# EAGLE design PSPS_AVNC_SRD_sensors-2020-09-19 (EAGLE 9.6.2)
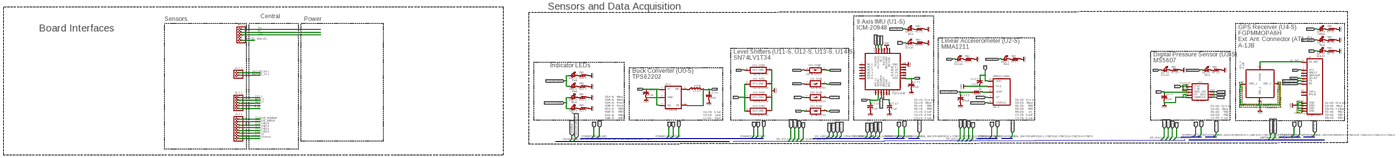
[diagram p0: schematic, sheet 1, overview]
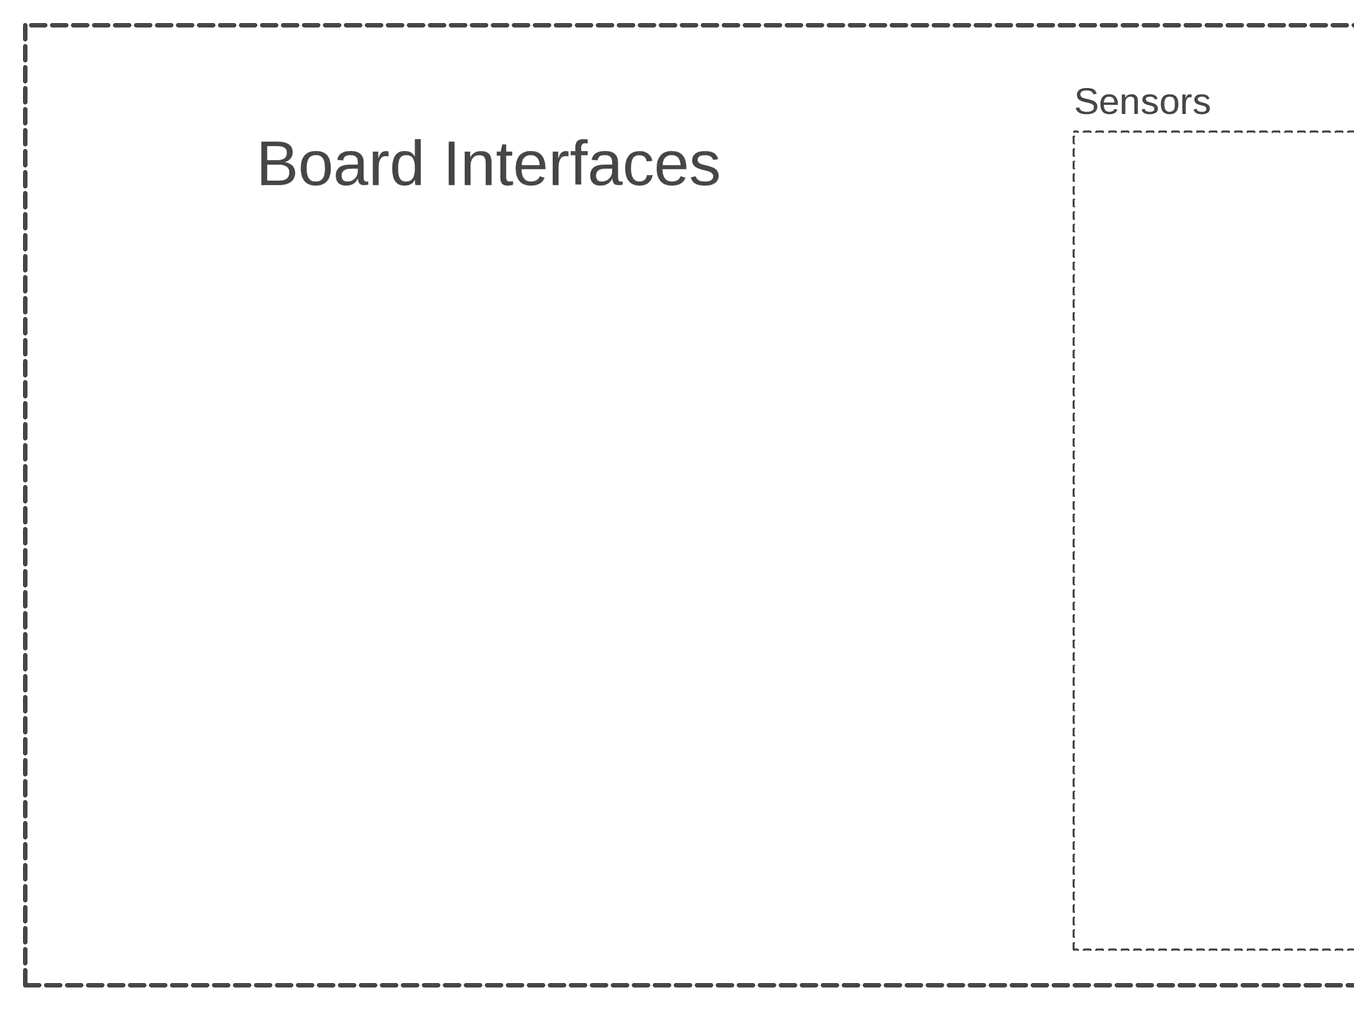
[diagram p1: schematic, sheet 1, part 1 of 4]
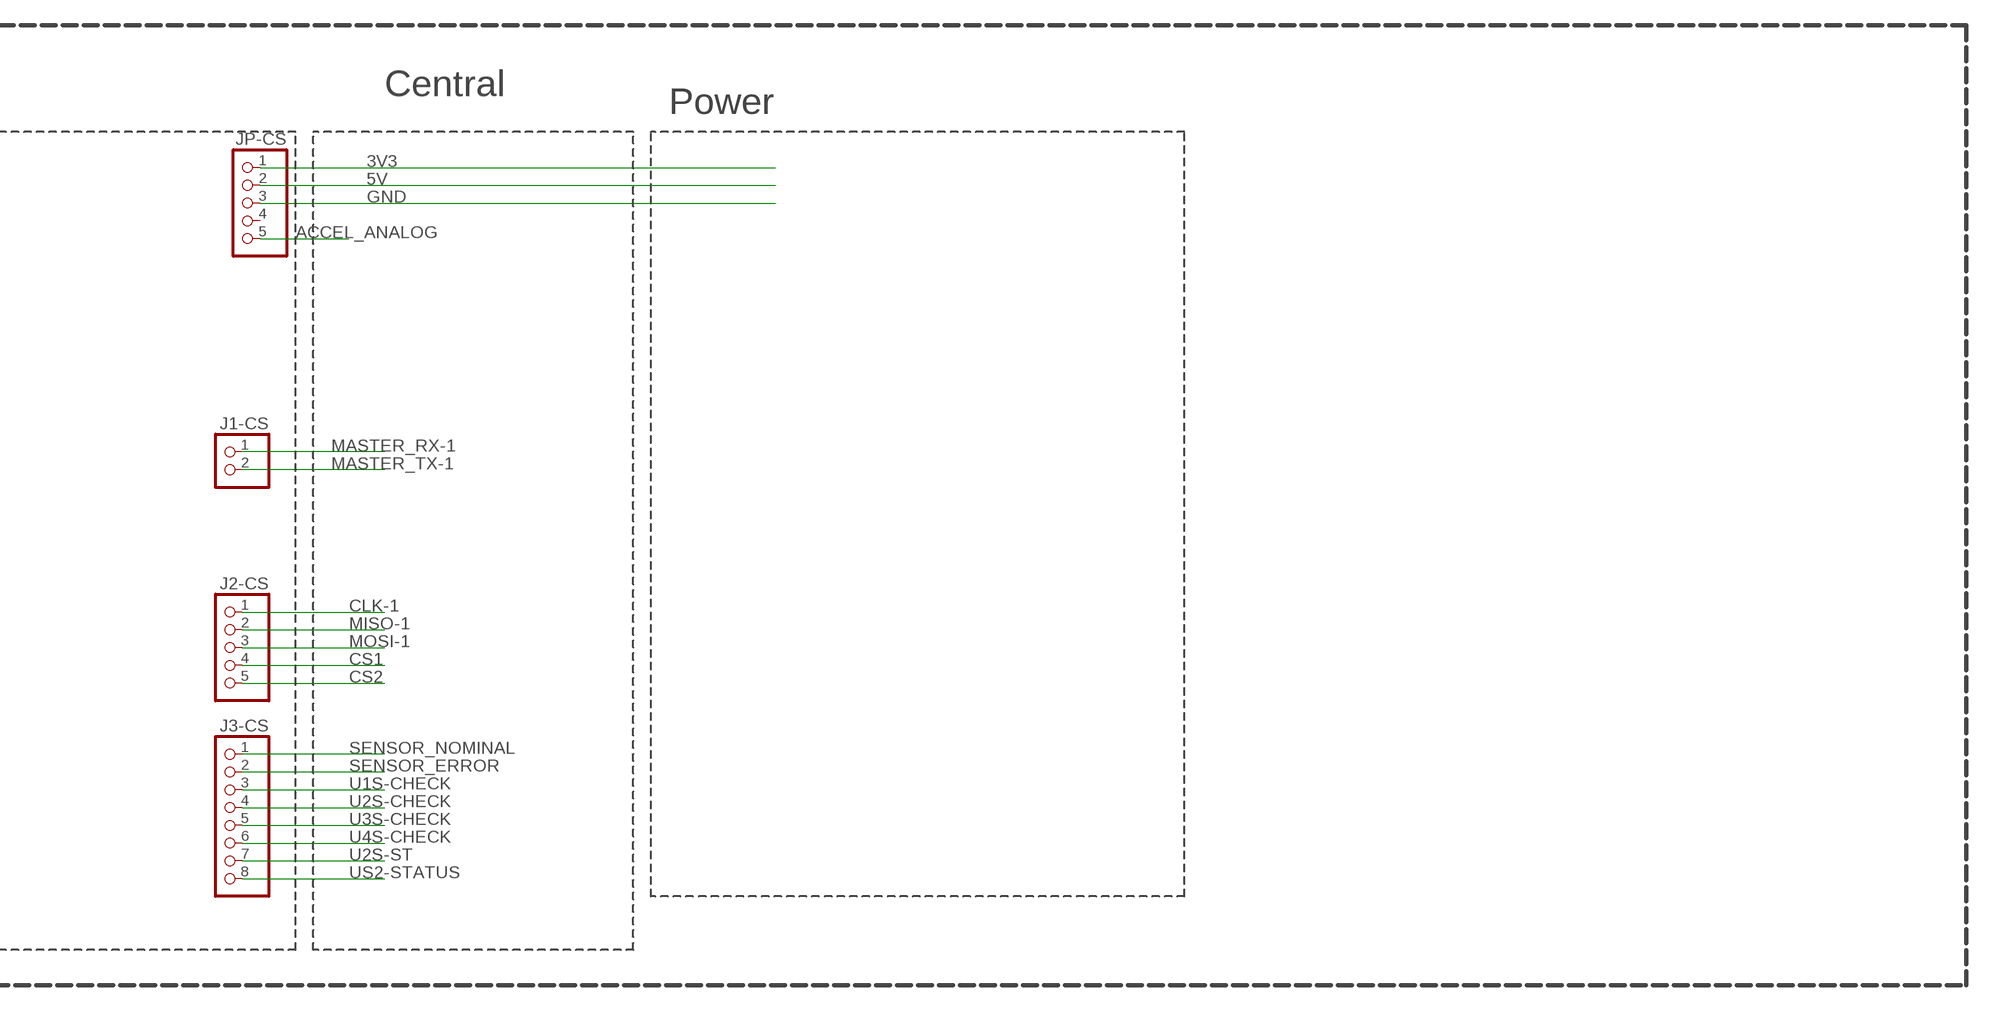
[diagram p2: schematic, sheet 1, part 2 of 4]
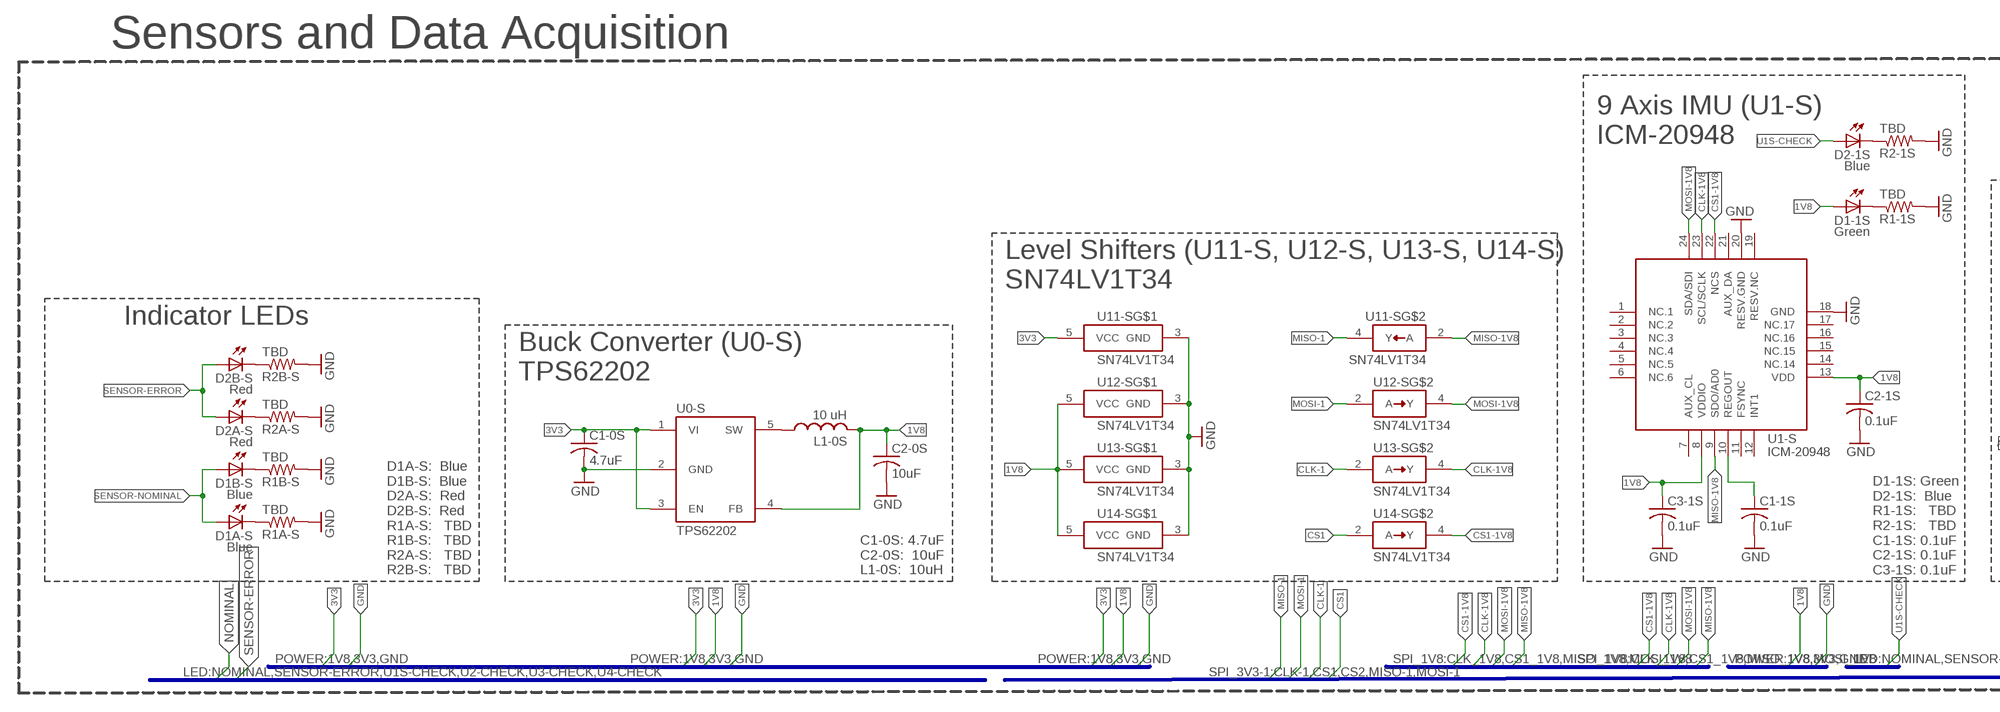
[diagram p3: schematic, sheet 1, part 3 of 4]
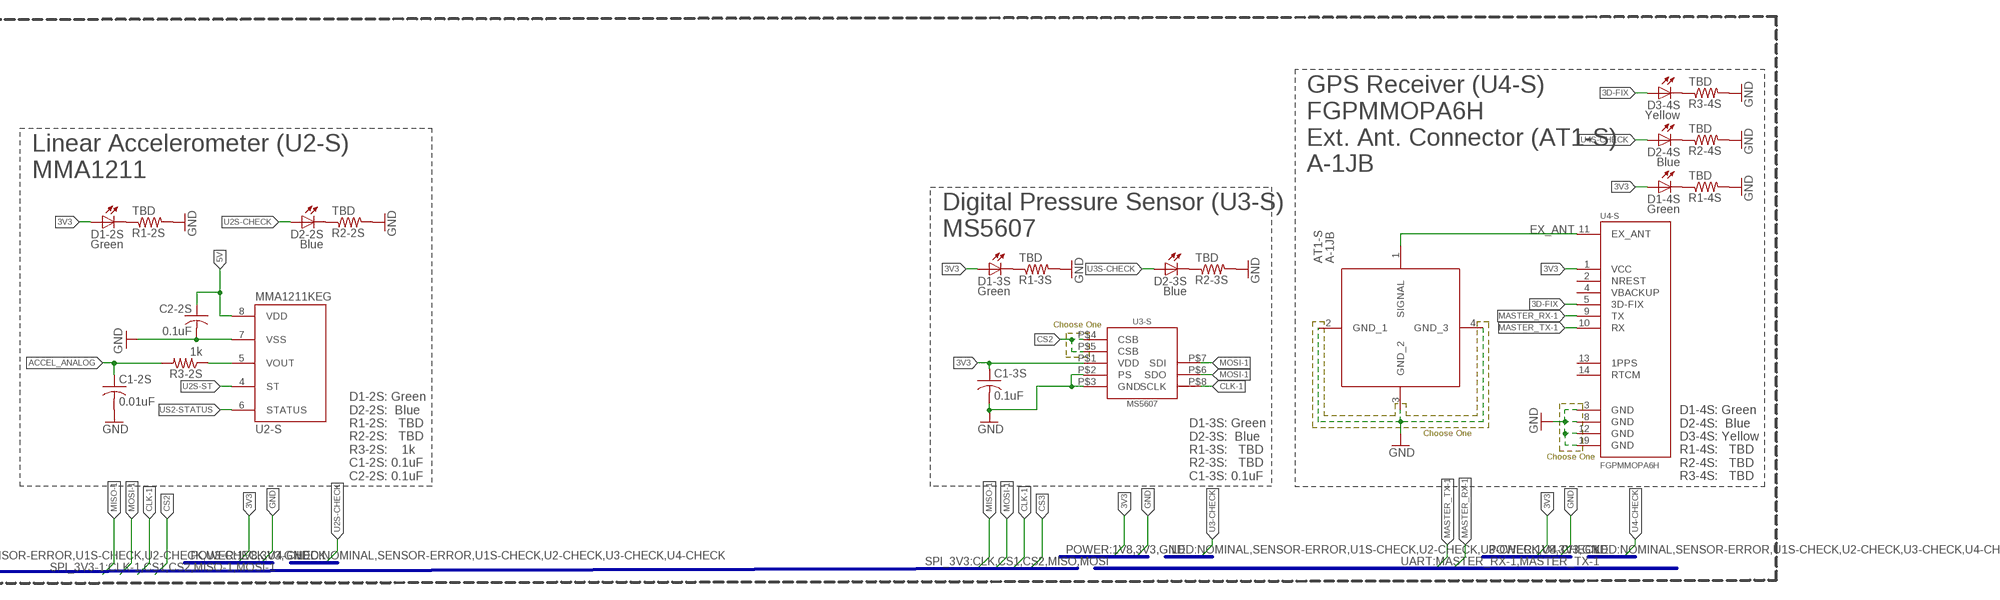
[diagram p4: schematic, sheet 1, part 4 of 4]

## Parts
AT1-S  A-1JB  [A1JB]
C1-0S  4.7uF  C-USC0805  [C0805]
C1-1S  0.1uF  C-USC0805  [C0805]
C1-2S  0.01uF  C-USC0805  [C0805]
C1-3S  0.1uF  C-USC0805  [C0805]
C2-0S  10uF  C-USC0805  [C0805]
C2-1S  0.1uF  C-USC0805  [C0805]
C2-2S  0.1uF  C-USC0805  [C0805]
C3-1S  0.1uF  C-USC0805  [C0805]
D1-1S  Green  LEDCHIPLED_0805  [CHIPLED_0805]
D1-2S  Green  LEDCHIPLED_0805  [CHIPLED_0805]
D1-3S  Green  LEDCHIPLED_0805  [CHIPLED_0805]
D1-4S  Green  LEDCHIPLED_0805  [CHIPLED_0805]
D1A-S  Blue  LEDCHIPLED_0805  [CHIPLED_0805]
D1B-S  Blue  LEDCHIPLED_0805  [CHIPLED_0805]
D2-1S  Blue  LEDCHIPLED_0805  [CHIPLED_0805]
D2-2S  Blue  LEDCHIPLED_0805  [CHIPLED_0805]
D2-3S  Blue  LEDCHIPLED_0805  [CHIPLED_0805]
D2-4S  Blue  LEDCHIPLED_0805  [CHIPLED_0805]
D2A-S  Red  LEDCHIPLED_0805  [CHIPLED_0805]
D2B-S  Red  LEDCHIPLED_0805  [CHIPLED_0805]
D3-4S  Yellow  LEDCHIPLED_0805  [CHIPLED_0805]
J1-CS  PINHD-1X2  [1X02]
J2-CS  PINHD-1X5  [1X05]
J3-CS  PINHD-1X8  [1X08]
JP-CS  PINHD-1X5  [1X05]
L1-0S  10 uH  PF0560.103NLT  [PF0560NL]
R1-1S  TBD  R-US_R0805  [R0805]
R1-2S  TBD  R-US_R0805  [R0805]
R1-3S  TBD  R-US_R0805  [R0805]
R1-4S  TBD  R-US_R0805  [R0805]
R1A-S  TBD  R-US_R0805  [R0805]
R1B-S  TBD  R-US_R0805  [R0805]
R2-1S  TBD  R-US_R0805  [R0805]
R2-2S  TBD  R-US_R0805  [R0805]
R2-3S  TBD  R-US_R0805  [R0805]
R2-4S  TBD  R-US_R0805  [R0805]
R2A-S  TBD  R-US_R0805  [R0805]
R2B-S  TBD  R-US_R0805  [R0805]
R3-2S  1k  R-US_R0805  [R0805]
R3-4S  TBD  R-US_R0805  [R0805]
U0-S  TPS62202  [SOT95P280X145-5]
U1-S  ICM-20948  [QFN40P300X300X105-25T159X175]
U2-S  MMA1211KEG  [SOIC127P1041X355-16N]
U3-S  MS5607  [MS5607]
U4-S  FGPMMOPA6H  [SOIC127P1800X470-20N]
U11-S  SN74LV1T34  [SOT65P210X110-5]
U12-S  SN74LV1T34  [SOT65P210X110-5]
U13-S  SN74LV1T34  [SOT65P210X110-5]
U14-S  SN74LV1T34  [SOT65P210X110-5]

## Nets
1V8: C2-0S.1 C2-1S.1 C3-1S.1 D1-1S.A L1-0S.P$2 U0-S.4(FB) U1-S.8(VDDIO) U1-S.13(VDD) U12-S.5(VCC) U13-S.5(VCC) U14-S.5(VCC)
3D-FIX: D3-4S.A U4-S.5(3D-FIX)
3V3: C1-0S.1 C1-3S.1 D1-2S.A D1-3S.A D1-4S.A JP-CS.1 U0-S.1(VI) U0-S.3(EN) U3-S.P$1(VDD) U4-S.1(VCC) U11-S.5(VCC)
5V: C2-2S.1 JP-CS.2 U2-S.8(VDD)
ACCEL_ANALOG: C1-2S.1 JP-CS.5 R3-2S.2
CLK-1: J2-CS.1 U3-S.P$8(SCLK) U13-S.2(A)
CLK-1V8: U1-S.23(SCL/SCLK) U13-S.4(Y)
CS1: J2-CS.4 U14-S.2(A)
CS1-1V8: U1-S.22(NCS) U14-S.4(Y)
CS2: J2-CS.5 U3-S.P$4(CSB) U3-S.P$5(CSB)
D1-1S_R1-1S: D1-1S.C R1-1S.1
D1-2S_R1-2S: D1-2S.C R1-2S.1
D1-3S_R1-3S: D1-3S.C R1-3S.1
D1-4S_R1-4S: D1-4S.C R1-4S.1
D1A-S_R1A-S: D1A-S.C R1A-S.1
D1B-S_R1B-S: D1B-S.C R1B-S.1
D2-1S_R2-1S: D2-1S.C R2-1S.1
D2-2S_R2-2S: D2-2S.C R2-2S.1
D2-3S_R2-3S: D2-3S.C R2-3S.1
D2-4S_R2-4S: D2-4S.C R2-4S.1
D2A-S_R2A-S: D2A-S.C R2A-S.1
D2B-S_R2B-S: D2B-S.C R2B-S.1
D3-4S_R3-4S: D3-4S.C R3-4S.1
EX_ANT: AT1-S.1(SIGNAL) U4-S.11(EX_ANT)
GND: AT1-S.2(GND_1) AT1-S.3(GND_2) AT1-S.4(GND_3) C1-0S.2 C1-1S.2 C1-2S.2 C1-3S.2 C2-0S.2 C2-1S.2 C2-2S.2 C3-1S.2 JP-CS.3 R1-1S.2 R1-2S.2 R1-3S.2 R1-4S.2 R1A-S.2 R1B-S.2 R2-1S.2 R2-2S.2 R2-3S.2 R2-4S.2 R2A-S.2 R2B-S.2 R3-4S.2 U0-S.2(GND) U1-S.18(GND) U1-S.20(RESV.GND) U2-S.7(VSS) U3-S.P$2(PS) U3-S.P$3(GND) U4-S.3(GND) U4-S.8(GND) U4-S.12(GND) U4-S.19(GND) U11-S.3(GND) U12-S.3(GND) U13-S.3(GND) U14-S.3(GND)
MASTER_RX-1: J1-CS.1 U4-S.9(TX)
MASTER_TX-1: J1-CS.2 U4-S.10(RX)
MISO-1: J2-CS.2 U11-S.4(Y)
MISO-1V8: U1-S.9(SDO/AD0) U11-S.2(A)
MOSI-1: J2-CS.3 U3-S.P$6(SDO) U3-S.P$7(SDI) U12-S.2(A)
MOSI-1V8: U1-S.24(SDA/SDI) U12-S.4(Y)
REGOUT: C1-1S.1 U1-S.10(REGOUT)
SENSOR-ERROR: D2A-S.A D2B-S.A
SENSOR-NOMINAL: D1A-S.A D1B-S.A
SENSOR_ERROR: J3-CS.2
SENSOR_NOMINAL: J3-CS.1
U0S-SW: L1-0S.P$1 U0-S.5(SW)
U1S-CHECK: D2-1S.A J3-CS.3
U2S-CHECK: D2-2S.A J3-CS.4
U2S-ST: J3-CS.7 U2-S.4(ST)
U3S-CHECK: D2-3S.A J3-CS.5
U4S-CHECK: D2-4S.A J3-CS.6
US2-STATUS: J3-CS.8 U2-S.6(STATUS)
VOUT: R3-2S.1 U2-S.5(VOUT)
Unconnected: JP-CS.4 U1-S.1(NC.1) U1-S.2(NC.2) U1-S.3(NC.3) U1-S.4(NC.4) U1-S.5(NC.5) U1-S.6(NC.6) U1-S.7(AUX_CL) U1-S.11(FSYNC) U1-S.12(INT1) U1-S.14(NC.14) U1-S.15(NC.15) U1-S.16(NC.16) U1-S.17(NC.17) U1-S.19(RESV.NC) U1-S.21(AUX_DA) U4-S.2(NREST) U4-S.4(VBACKUP) U4-S.13(1PPS) U4-S.14(RTCM)

## Buses
SPI_3V3:CLK,CS1,CS2,MISO,MOSI
SPI_1V8:CLK_1V8,CS1_1V8,MISO_1V8,MOSI_1V8
POWER:1V8,3V3,GND
LED:NOMINAL,SENSOR-ERROR,U1S-CHECK,U2-CHECK,U3-CHECK,U4-CHECK
UART:MASTER_RX-1,MASTER_TX-1
SPI_3V3-1:CLK-1,CS1,CS2,MISO-1,MOSI-1

## Notes on the sheet
- Sensors and Data Acquisition
- Central
- Sensors | Power
- 9 Axis IMU (U1-S)
  ICM-20948
- Board Interfaces
- GPS Receiver (U4-S)
  FGPMMOPA6H
  Ext. Ant. Connector (AT1-S)
  A-1JB
- Linear Accelerometer (U2-S)
  MMA1211
- Level Shifters (U11-S, U12-S, U13-S, U14-S)
  SN74LV1T34
- Digital Pressure Sensor (U3-S)
  MS5607
- Indicator LEDs
- Buck Converter (U0-S)
  TPS62202
- Choose One
- Choose One
- Choose One
- D1A-S:  Blue
  D1B-S:  Blue
  D2A-S:  Red
  D2B-S:  Red
  R1A-S:   TBD
  R1B-S:   TBD
  R2A-S:   TBD
  R2B-S:   TBD
- C1-0S: 4.7uF
  C2-0S:  10uF
  L1-0S:  10uH
- D1-1S: Green
  D2-1S:  Blue
  R1-1S:   TBD
  R2-1S:   TBD
  C1-1S: 0.1uF
  C2-1S: 0.1uF
  C3-1S: 0.1uF
- D1-2S: Green
  D2-2S:  Blue
  R1-2S:   TBD
  R2-2S:   TBD
  R3-2S:    1k
  C1-2S: 0.1uF
  C2-2S: 0.1uF
- D1-3S: Green
  D2-3S:  Blue
  R1-3S:   TBD
  R2-3S:   TBD
  C1-3S: 0.1uF
- D1-4S: Green
  D2-4S:  Blue
  D3-4S: Yellow
  R1-4S:   TBD
  R2-4S:   TBD
  R3-4S:   TBD

## Library data of the parts
AT1-S = SamacSys_Parts:A-1JB: AMC Straight PCB Jack, Surface Mount Source: Datasheet <https://componentsearchengine.com/Datasheets/1/A-1JB.pdf>; DESCRIPTION: AMC Straight PCB Jack, Surface Mount; HEIGHT: 1.05mm; MANUFACTURER_NAME: Amphenol; MANUFACTURER_PART_NUMBER: A-1JB; MOUSER_PART_NUMBER: 523-A-1JB; MOUSER_PRICE-STOCK: https://www.mouser.com/Search/Refine.aspx?Keyword=523-A-1JB
C1-0S C1-1S C1-2S C1-3S C2-0S C2-1S C2-2S C3-1S = resistor:C-US: CAPACITOR, American symbol
D1-1S D1-2S D1-3S D1-4S D1A-S D1B-S D2-1S D2-2S D2-3S D2-4S D2A-S D2B-S D3-4S = adafruit:LED: LED OSRAM: - CHIPLED LG R971, LG N971, LY N971, LG Q971, LY Q971, LO R971, LY R971 LH N974, LH R974 LS Q976, LO Q976, LY Q976 LO Q996 - Hyper CHIPLED LW Q18S LB Q993, LB Q99A, LB R99A - SideLED LS A670, LO A670, LY A670, LG A670, LP A670 LB A673, LV A673, LT A673, LW A673 LH A674 LY A675 LS A676, LA A676, LO A676, LY A676, LW A676 LS A679, LY A679, LG A679 - Hyper Micro SIDELED® LS Y876, LA Y876, LO Y876, LY Y876 LT Y87S - SmartLED LW L88C, LW L88S LB L89C, LB L89S, LG L890 LS L89K, LO L89K, LY L89K LS L896, LA L896, LO L896, LY L896 - TOPLED LS T670, LO T670, LY T670, LG T670, LP T670 LSG T670, LSP T670, LSY T670, LOP T670, LYG T670 LG T671, LOG T671, LSG T671 LB T673, LV T673, LT T673, LW T673 LH T674 LS T676, LA T676, LO T676, LY T676, LB T676, LH T676, LSB T676, LW T676 LB T67C, LV T67C, LT T67C, LS T67K, LO T67K, LY T67K, LW E67C LS E67B, LA E67B, LO E67B, LY E67B, LB E67C, LV E67C, LT E67C LW T67C LS T679, LY T679, LG T679 LS T770, LO T770, LY T770, LG T770, LP T770 LB T773, LV T773, LT T773, LW T773 LH T774 LS E675, LA E675, LY E675, LS T675 LS T776, LA T776, LO T776, LY T776, LB T776 LHGB T686 LT T68C, LB T68C - Hyper Mini TOPLED® LB M676 - Mini TOPLED Santana® LG M470 LS M47K, LO M47K, LY M47K Source: http://www.osram.convergy.de/
J1-CS = pinhead:PINHD-1X2: PIN HEADER
J2-CS JP-CS = pinhead:PINHD-1X5: PIN HEADER
J3-CS = pinhead:PINHD-1X8: PIN HEADER
L1-0S = Computer2:PF0560.103NLT: Fixed Inductors INDUCTOR PWR SHIELD 10UH SMD https://www.mouser.com/ProductDetail/Pulse-Electronics/PF0560103NLT?qs=sGAEpiMZZMsg%252By3WlYCkU%252BCbm%2FyM2yLshO29DWrNRHI%3D
R1-1S R1-2S R1-3S R1-4S R1A-S R1B-S R2-1S R2-2S R2-3S R2-4S R2A-S R2B-S R3-2S R3-4S = resistor:R-US_: RESISTOR, American symbol
U0-S = Computer2:TPS62202: 1.8-V Output, 300-mA, 95% Efficient Step-Down Converter in SOT-23 http://www.ti.com/product/TPS62202
U1-S = Computer2:ICM-20948: 9 Axis Motion Sensor from TDK InvenSense https://store.invensense.com/products/detail/ICM20948-InvenSense/597203/
U2-S = Computer2:MMA1211KEG
U3-S = Computer2:MS5607
U4-S = Computer2:FGPMMOPA6H
U11-S U12-S U13-S U14-S = Computer2:SN74LV1T34: Single Power Supply BUFFER Logic Level Shifter

## Board
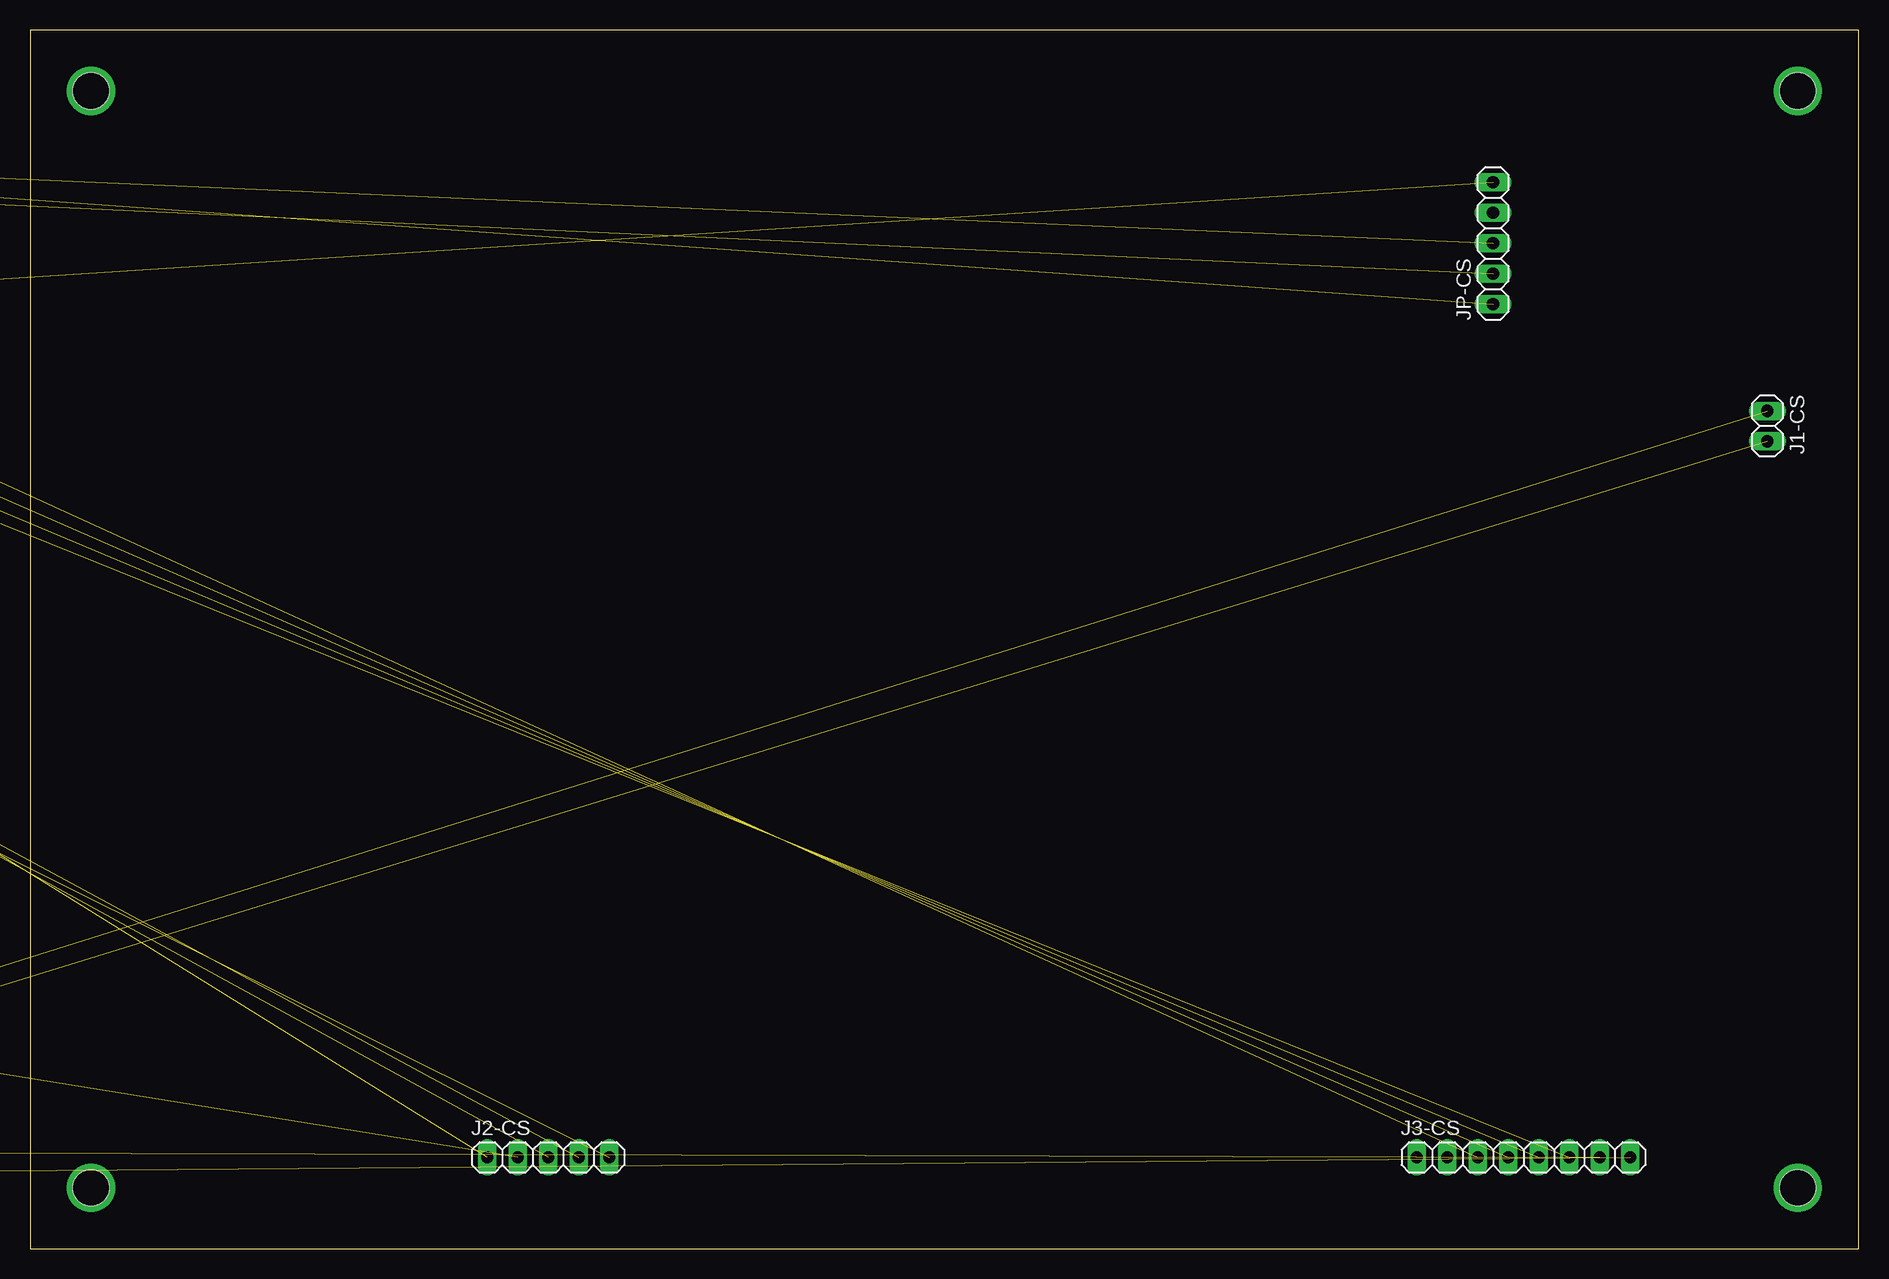
[diagram p5: board, top side]
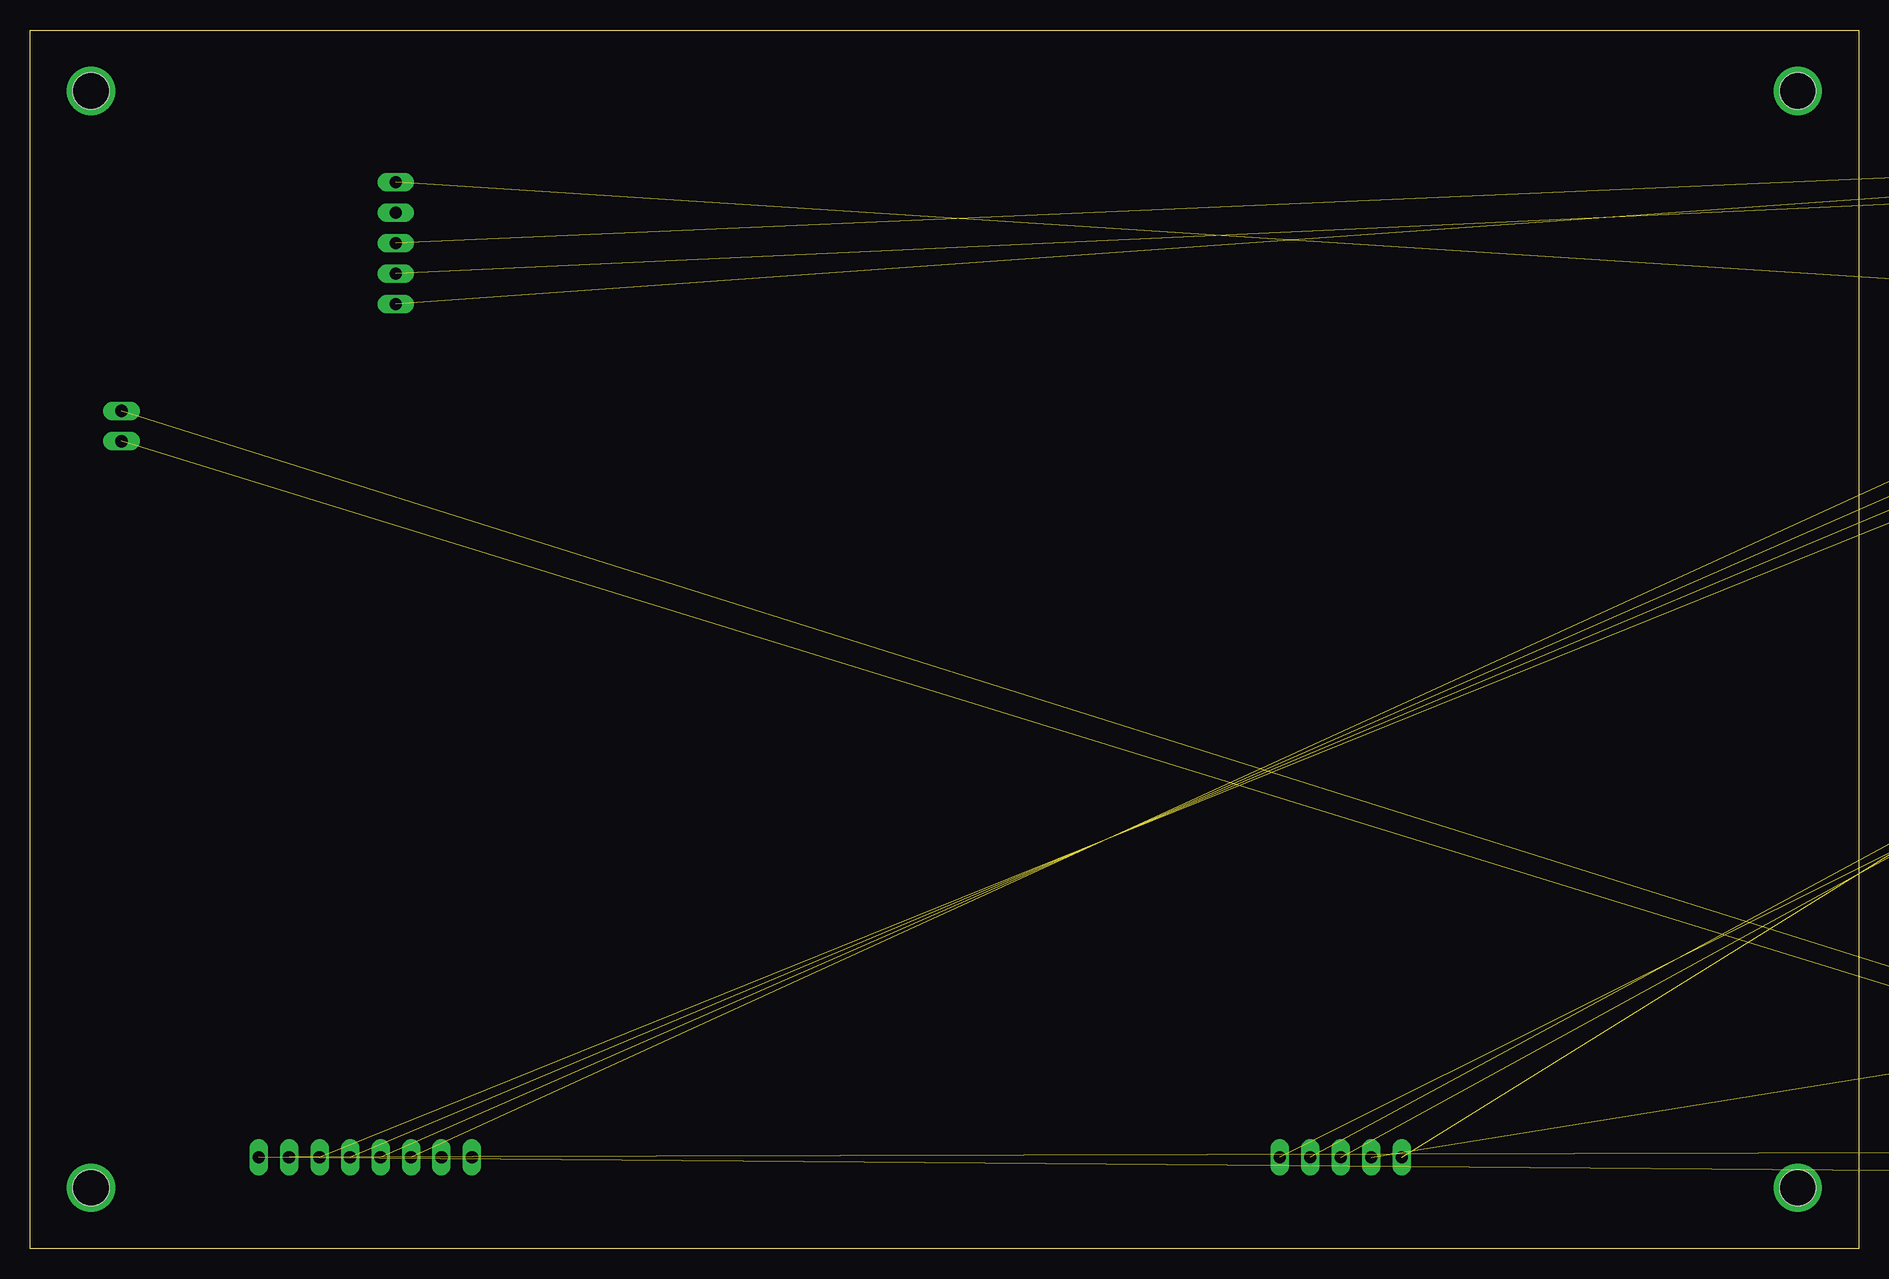
[diagram p6: board, bottom side, seen from below]

Size 152.4 x 101.6 mm. Coordinates in mm from the lower left corner, seen from the top.
Outline: 0,0 152.4,0 152.4,101.6 0,101.6 0,0
Copper layers (1*16): Top 0.035mm / dielectric 1.5mm / Bottom 0.035mm
Design rules "default": minimum track width 6mil, minimum drill 0.35mm, track to track 6mil, track to pad 6mil, pad to pad 6mil, via to via 6mil, smd to smd 6mil, copper to edge 40mil, drill to drill 6mil, minimum pad ring 10mil, minimum via ring 8mil, stop-mask expansion 4mil, vias tented up to drill 0mil, thermal gap 10mil
Holes 3 mm at 5.08,96.52 147.32,96.52 147.32,5.08 5.08,5.08

### Footprints (pad centres in the part's own frame; a part is rotated, then mirrored left to right if it is on the bottom)
A1JB = smd 0.6 x 1.4: 1 1.525,0; 3 -1.525,0 | smd 2.2 x 1.05: 2 0,1.475; 4 0,-1.475
C0805 = smd 1.3 x 1.5: 1 -0.95,0; 2 0.95,0
CHIPLED_0805 = smd 1.2 x 1.2: A 0,-1.05; C 0,1.05
1X02 = drill 1.016 long: 1 -1.27,0; 2 1.27,0
1X05 = drill 1.016 long: 1 -5.08,0; 2 -2.54,0; 3 0,0; 4 2.54,0; 5 5.08,0
1X08 = drill 1.016 long: 1 -8.89,0; 2 -6.35,0; 3 -3.81,0; 4 -1.27,0; 5 1.27,0; 6 3.81,0; 7 6.35,0; 8 8.89,0
PF0560NL = smd 3.81 x 1.93: P$1 0,-4.5; P$2 0,4.5
R0805 = smd 1.3 x 1.5: 1 -0.95,0; 2 0.95,0
SOT95P280X145-5 = smd 1.259 x 0.609: 1 -1.228,0.95; 2 -1.228,0; 3 -1.228,-0.95; 4 1.228,-0.95; 5 1.228,0.95
QFN40P300X300X105-25T159X175 = smd 0.738 x 0.22: 1 -1.496,1; 2 -1.496,0.6; 3 -1.496,0.2; 4 -1.496,-0.2; 5 -1.496,-0.6; 6 -1.496,-1; 13 1.496,-1; 14 1.496,-0.6; 15 1.496,-0.2; 16 1.496,0.2; 17 1.496,0.6; 18 1.496,1 | smd 0.22 x 0.738: 7 -1,-1.496; 8 -0.6,-1.496; 9 -0.2,-1.496; 10 0.2,-1.496; 11 0.6,-1.496; 12 1,-1.496; 19 1,1.496; 20 0.6,1.496; 21 0.2,1.496; 22 -0.2,1.496; 23 -0.6,1.496; 24 -1,1.496 | smd 1.59 x 1.75: 25 0,0
SOIC127P1041X355-16N = smd 1.973 x 0.589: 1 -4.705,4.445; 2 -4.705,3.175; 3 -4.705,1.905; 4 -4.705,0.635; 5 -4.705,-0.635; 6 -4.705,-1.905; 7 -4.705,-3.175; 8 -4.705,-4.445; 9 4.705,-4.445; 10 4.705,-3.175; 11 4.705,-1.905; 12 4.705,-0.635; 13 4.705,0.635; 14 4.705,1.905; 15 4.705,3.175; 16 4.705,4.445
MS5607 = smd 1.1 x 0.6: P$1 -1.1,1.875; P$2 -1.1,0.625; P$3 -1.1,-0.625; P$4 -1.1,-1.875; P$5 1.1,-1.875; P$6 1.1,-0.625; P$7 1.1,0.625; P$8 1.1,1.875
SOIC127P1800X470-20N = smd 2.54 x 1.016: 1 -8.1,5.715; 2 -8.1,4.445; 3 -8.1,3.175; 4 -8.1,1.905; 5 -8.1,0.635; 6 -8.1,-0.635; 7 -8.1,-1.905; 8 -8.1,-3.175; 9 -8.1,-4.445; 10 -8.1,-5.715; 11 8.1,-5.715; 12 8.1,-4.445; 13 8.1,-3.175; 14 8.1,-1.905; 15 8.1,-0.635; 16 8.1,0.635; 17 8.1,1.905; 18 8.1,3.175; 19 8.1,4.445; 20 8.1,5.715
SOT65P210X110-5 = smd 1.186 x 0.397: 1 -0.962,0.65; 2 -0.962,0; 3 -0.962,-0.65; 4 0.962,-0.65; 5 0.962,0.65

### Placement (x,y rotation side)
AT1-S  -44.45,102.87 0 top  (outside the outline)
C1-0S  -115.57,83.82 0 top  (outside the outline)
C1-1S  -24.13,90.17 0 top  (outside the outline)
C1-2S  -86.36,77.47 0 top  (outside the outline)
C1-3S  -36.83,90.17 0 top  (outside the outline)
C2-0S  -49.53,90.17 0 top  (outside the outline)
C2-1S  -62.23,90.17 0 top  (outside the outline)
C2-2S  -68.58,90.17 0 top  (outside the outline)
C3-1S  -81.28,90.17 0 top  (outside the outline)
D1-1S  -57.15,101.6 0 top  (outside the outline)
D1-2S  -63.5,101.6 0 top  (outside the outline)
D1-3S  -69.85,101.6 0 top  (outside the outline)
D1-4S  -76.2,101.6 0 top  (outside the outline)
D1A-S  -83.82,49.53 0 top  (outside the outline)
D1B-S  -90.17,49.53 0 top  (outside the outline)
D2-1S  -82.55,101.6 0 top  (outside the outline)
D2-2S  -88.9,101.6 0 top  (outside the outline)
D2-3S  -95.25,101.6 0 top  (outside the outline)
D2-4S  -101.6,101.6 0 top  (outside the outline)
D2A-S  -96.52,49.53 0 top  (outside the outline)
D2B-S  -102.87,49.53 0 top  (outside the outline)
D3-4S  -38.1,101.6 0 top  (outside the outline)
J1-CS  144.78,68.58 270 top
J2-CS  43.18,7.62 0 top
J3-CS  124.46,7.62 0 top
JP-CS  121.92,83.82 90 top
L1-0S  -106.68,7.62 0 top  (outside the outline)
R1-1S  -63.5,71.12 0 top  (outside the outline)
R1-2S  -78.74,71.12 0 top  (outside the outline)
R1-3S  -86.36,71.12 0 top  (outside the outline)
R1-4S  -93.98,71.12 0 top  (outside the outline)
R1A-S  -87.63,64.77 0 top  (outside the outline)
R1B-S  -95.25,64.77 0 top  (outside the outline)
R2-1S  -116.84,71.12 0 top  (outside the outline)
R2-2S  -25.4,77.47 0 top  (outside the outline)
R2-3S  -33.02,77.47 0 top  (outside the outline)
R2-4S  -40.64,77.47 0 top  (outside the outline)
R2A-S  -102.87,64.77 0 top  (outside the outline)
R2B-S  -110.49,64.77 0 top  (outside the outline)
R3-2S  -55.88,77.47 0 top  (outside the outline)
R3-4S  -63.5,77.47 0 top  (outside the outline)
U0-S  -71.12,29.21 0 top  (outside the outline)
U1-S  -53.34,29.21 0 top  (outside the outline)
U2-S  -93.98,7.62 0 top  (outside the outline)
U3-S  -35.56,50.8 0 top  (outside the outline)
U4-S  -46.99,11.43 0 top  (outside the outline)
U11-S  -90.17,29.21 0 top  (outside the outline)
U12-S  -102.87,29.21 0 top  (outside the outline)
U13-S  -115.57,29.21 0 top  (outside the outline)
U14-S  -19.05,43.18 0 top  (outside the outline)

### Tracks (layer width: path | path; a pad name or v marks a point on that pad's centre or on a via)
1V8  (10 unrouted)
3D-FIX  (1 unrouted)
3V3  (10 unrouted)
5V  (2 unrouted)
ACCEL_ANALOG  (2 unrouted)
CLK-1  (2 unrouted)
CLK-1V8  (1 unrouted)
CS1  (1 unrouted)
CS1-1V8  (1 unrouted)
CS2  (2 unrouted)
D1-1S_R1-1S  (1 unrouted)
D1-2S_R1-2S  (1 unrouted)
D1-3S_R1-3S  (1 unrouted)
D1-4S_R1-4S  (1 unrouted)
D1A-S_R1A-S  (1 unrouted)
D1B-S_R1B-S  (1 unrouted)
D2-1S_R2-1S  (1 unrouted)
D2-2S_R2-2S  (1 unrouted)
D2-3S_R2-3S  (1 unrouted)
D2-4S_R2-4S  (1 unrouted)
D2A-S_R2A-S  (1 unrouted)
D2B-S_R2B-S  (1 unrouted)
D3-4S_R3-4S  (1 unrouted)
EX_ANT  (1 unrouted)
GND  (38 unrouted)
MASTER_RX-1  (1 unrouted)
MASTER_TX-1  (1 unrouted)
MISO-1  (1 unrouted)
MISO-1V8  (1 unrouted)
MOSI-1  (3 unrouted)
MOSI-1V8  (1 unrouted)
N$1  (via drill 3 pad 4)
  other vias: 5.08,5.08
N$3  (via drill 3 pad 4)
  other vias: 5.08,96.52
N$4  (via drill 3 pad 4)
  other vias: 147.32,96.52
N$5  (via drill 3 pad 4)
  other vias: 147.32,5.08
REGOUT  (1 unrouted)
SENSOR-ERROR  (1 unrouted)
SENSOR-NOMINAL  (1 unrouted)
U0S-SW  (1 unrouted)
U1S-CHECK  (1 unrouted)
U2S-CHECK  (1 unrouted)
U2S-ST  (1 unrouted)
U3S-CHECK  (1 unrouted)
U4S-CHECK  (1 unrouted)
US2-STATUS  (1 unrouted)
VOUT  (1 unrouted)